# Altium project PiezoControlBoard.PrjPcb (part 2 of 2)

## Sheet Power_Management.SchDoc
size 419 x 297 mm; SheetNumber: 2; SheetTotal: 5
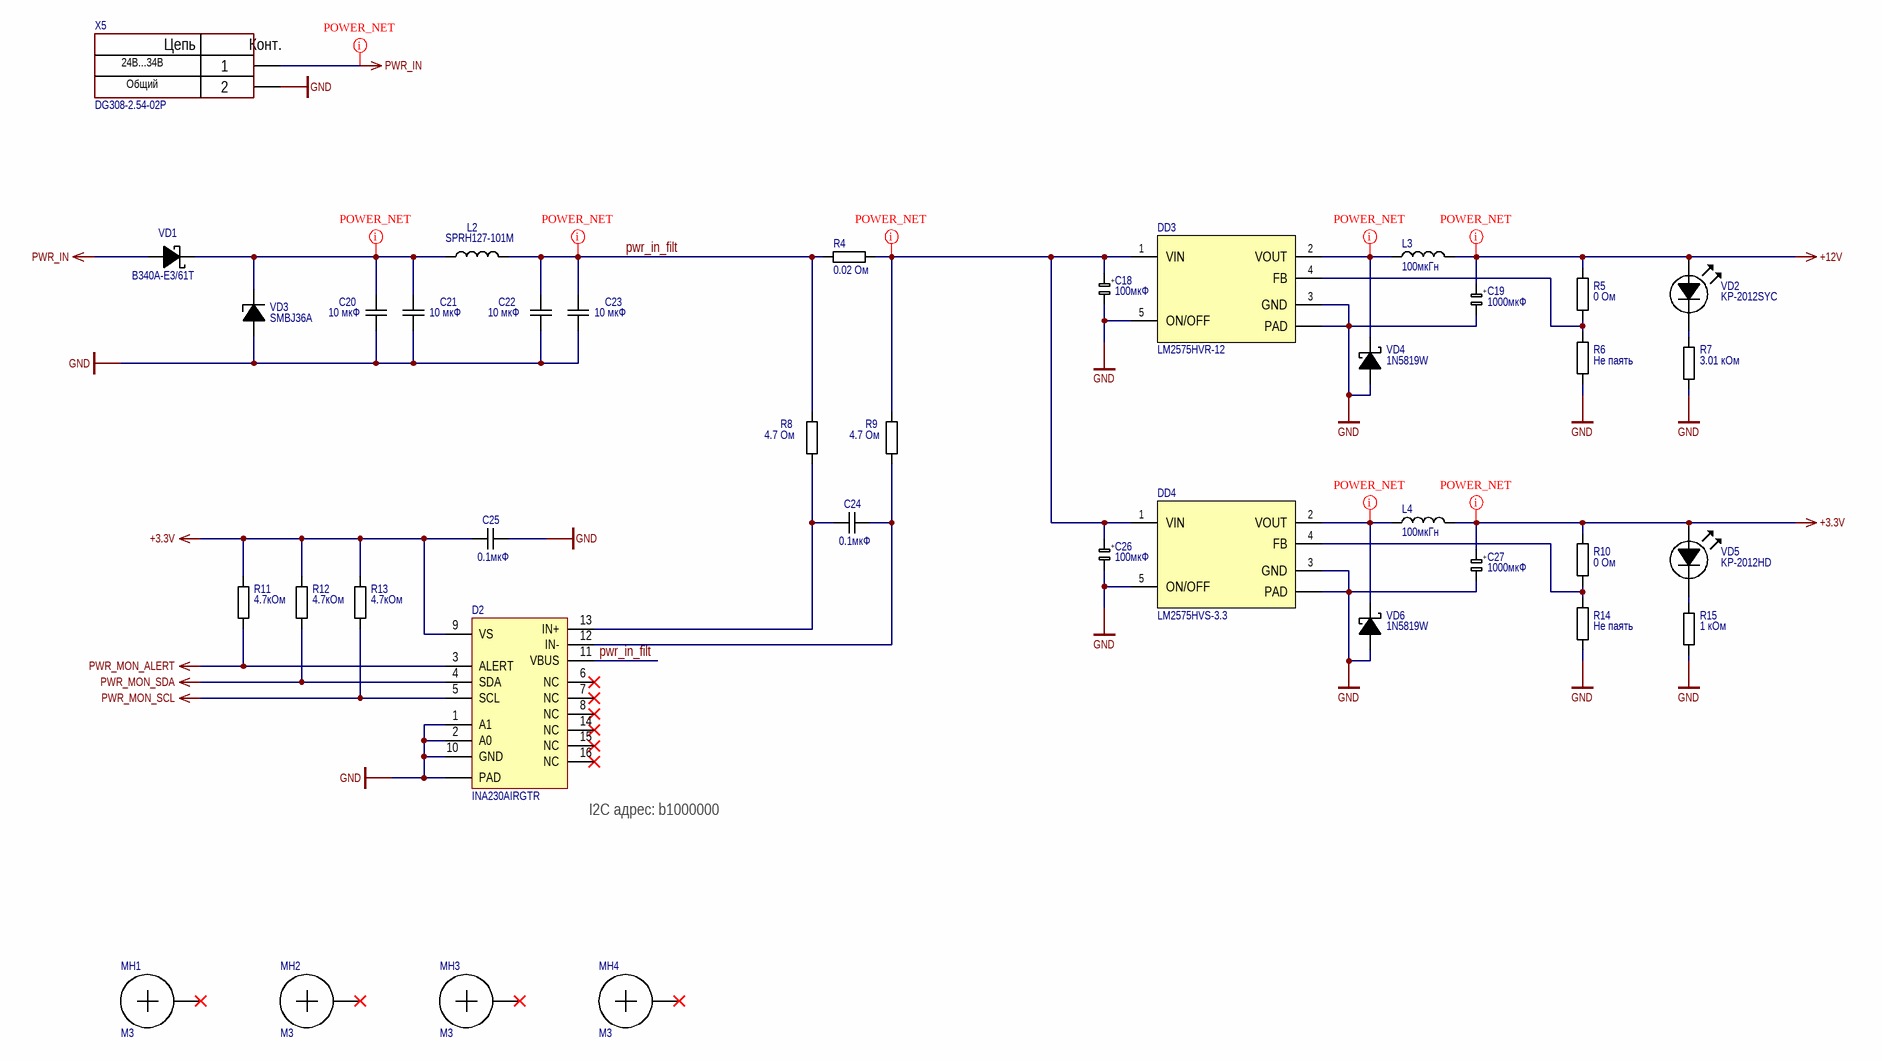
[diagram p1: Power_Management.SchDoc]

### Parts
(Parts that share a designator on the sheet are numbered #1, #2 ... from top to bottom, then left to right.)
C18#2  value 100мкФ  [CAP_RADIAL_10x20_P5]  (hidden comment: CAP-100мкФ-20%-100В-105°C-Radial)
C19#2  value 1000мкФ  [CAP_RADIAL_10x20_P5]  (hidden comment: CAP-1000мкФ-20%-25В-105°C-Radial)
C20  value 10 мкФ  [CAP_1206]  (hidden comment: CAP-10 мкФ-10%-50 В-X5R-1206)
C21  value 10 мкФ  [CAP_1206]  (hidden comment: CAP-10 мкФ-10%-50 В-X5R-1206)
C22  value 10 мкФ  [CAP_1206]  (hidden comment: CAP-10 мкФ-10%-50 В-X5R-1206)
C23  value 10 мкФ  [CAP_1206]  (hidden comment: CAP-10 мкФ-10%-50 В-X5R-1206)
C24  value 0.1мкФ  [CAP-0603]  (hidden comment: CAP-0.1мкФ-10%-50В-X7R-0603)
C25  value 0.1мкФ  [CAP-0603]  (hidden comment: CAP-0.1мкФ-10%-50В-X7R-0603)
C26  value 100мкФ  [CAP_RADIAL_10x20_P5]  (hidden comment: CAP-100мкФ-20%-100В-105°C-Radial)
C27  value 1000мкФ  [CAP_RADIAL_10x20_P5]  (hidden comment: CAP-1000мкФ-20%-25В-105°C-Radial)
D2  INA230AIRGTR  [VQFN-16]
DD3  LM2575HVR-12  [TO-263-5]
DD4  LM2575HVS-3.3  [TO-263-5]
L2  SPRH127-101M  [IND_SPRH127-101M]
L3  100мкГн  [IND_10.4X10.4]
L4  100мкГн  [IND_10.4X10.4]
MH1  M3  [M3]  (no BOM)
MH2  M3  [M3]  (no BOM)
MH3  M3  [M3]  (no BOM)
MH4  M3  [M3]  (no BOM)
R4#2  value 0.02 Ом  [RES-2512]  (hidden comment: RES-0.02 Ом-1%-3 Вт-2512)
R5#2  value 0 Ом  [RES-0402]  (hidden comment: RES-0 Ом-5%-0.062 Вт-0402)
R6#2  value Не паять  [RES-0402]  (hidden comment: RES-Не паять-----0402)
R7#2  value 3.01 кОм  [RES-0805]  (hidden comment: RES-3.01 кОм-1%-0.125Вт-0805)
R8#2  value 4.7 Ом  [RES-0402]  (hidden comment: RES-4.7 Ом-5%-0.062 Вт-0402)
R9#2  value 4.7 Ом  [RES-0402]  (hidden comment: RES-4.7 Ом-5%-0.062 Вт-0402)
R10  value 0 Ом  [RES-0402]  (hidden comment: RES-0 Ом-5%-0.062 Вт-0402)
R11  value 4.7кОм  [RES-0402]  (hidden comment: RES-4.7кОм-5%-0.062Вт-0402)
R12  value 4.7кОм  [RES-0402]  (hidden comment: RES-4.7кОм-5%-0.062Вт-0402)
R13  value 4.7кОм  [RES-0402]  (hidden comment: RES-4.7кОм-5%-0.062Вт-0402)
R14  value Не паять  [RES-0402]  (hidden comment: RES-Не паять-----0402)
R15  value 1 кОм  [RES-0805]  (hidden comment: RES-1 кОм-1%-0.125Вт-0805)
VD1#2  B340A-E3/61T  [DO-214AC]
VD2#2  KP-2012SYC  [LED 0805]
VD3  SMBJ36A  [DO-214AA]
VD4  1N5819W  [SOD-123]
VD5  KP-2012HD  [LED 0805]
VD6  1N5819W  [SOD-123]
X5#2  DG308-2.54-02P  Curciut 2: Общий  Curciut 1: 24В...34В  [DG30825402P1400AH]

### Nets
+3.3V: C25.1 C27.P D2.9(VS) L4.2 R10.2 R11.2 R12.2 R13.2 VD5.1(A)
+12V: C19#2.P L3.2 R5#2.2 VD2#2.1(A)
GND: C18#2.N C19#2.N C20.1 C21.1 C22.1 C23.1 C25.2 C26.N C27.N D2.1(A1) D2.2(A0) D2.10(GND) D2.PAD DD3.3(GND) DD3.5(ON/OFF) DD3.PAD DD4.3(GND) DD4.5(ON/OFF) DD4.PAD R6#2.1 R7#2.1 R14.1 R15.1 VD3.A VD4.1(A) VD6.1(A) X5#2.2
PWR_IN: VD1#2.A X5#2.1
PWR_MON_ALERT: D2.3(ALERT) R11.1
PWR_MON_SCL: D2.5(SCL) R13.1
PWR_MON_SDA: D2.4(SDA) R12.1
pwr_in_filt: C22.2 C23.2 D2.11(VBUS) L2.2 R4#2.1 R8#2.2
NetC18#2_P: C18#2.P C26.P DD3.1(VIN) DD4.1(VIN) R4#2.2 R9#2.2
NetC20_2: C20.2 C21.2 L2.1 VD1#2.C VD3.C
NetC24_1: C24.1 D2.13(IN+) R8#2.1
NetC24_2: C24.2 D2.12(IN-) R9#2.1
NetDD3_2: DD3.2(VOUT) L3.1 VD4.2(K)
NetDD3_4: DD3.4(FB) R5#2.1 R6#2.2
NetDD4_2: DD4.2(VOUT) L4.1 VD6.2(K)
NetDD4_4: DD4.4(FB) R10.1 R14.2
NetR7#2_2: R7#2.2 VD2#2.2(C)
NetR15_2: R15.2 VD5.2(C)

Not connected (* = marked no-connect by the designer): D2 6(NC)* 7(NC)* 8(NC)* 14(NC)* 15(NC)* 16(NC)*; MH1 1*; MH2 1*; MH3 1*; MH4 1*

### Layout directives
net class POWER_NET: +3.3V, +12V, NetC18#2_P, NetC20_2, NetDD3_2, NetDD4_2, PWR_IN, pwr_in_filt

### Notes on the sheet
- (near D2) I2C адрес: b1000000
- Перв. примен.
- Справ. №
- Подп. и дата
- Инв. № дубл.
- Взам. инв. №
- Изм.
- Лист
- № докум.
- Подп.
- Дата
- Инв. № подл.
- Копировал
- Формат А3
- (in symbol DG308-2.54-02P) Цепь; Конт.
- (in symbol JRB1E102M05001000210000B) +
- (in symbol JRB2A101M05001000200000B) +

### Library data of the parts
C18#2 C26 = JRB2A101M05001000200000B: 100мкФ, 100В, 105°C, 20%, 10x20мм P:5мм, JRB2A101M05001000200000B (К50-35 имп.), Конденсатор электролитический алюминиевый; Tolerance: 20%; Voltage: 100В; Manufacturer Part Number: JRB2A101M05001000200000B; Supplier 1: https://www.chipdip.ru/product/100mkf-100v-105-c-20-10x20mm-p-5mm-jb-capacitors-9000565887; Temperature: 105°C
C19#2 C27 = JRB1E102M05001000210000B: 1000мкФ, 25В, 105°C, 20%, 10x21мм P:5мм, JRB1E102M05001000210000B (К50-35 имп.), Конденсатор электролитический алюминиевый; Tolerance: 20%; Voltage: 25В; Manufacturer Part Number: JRB1E102M05001000210000B; Supplier 1: https://www.chipdip.ru/product/1000mkf-25v-105-c-20-10x21mm-p-5mm-jb-capacitors-9000565924; Temperature: 105°C
C20-C23 = Cap_1206: Конденсатор; Manufacturer Part Number: GRM31CR61H106KA12L; Tolerance: 10%; Voltage: 50 В; Temperature: X5R; Supplier 1: https://www.chipdip.ru/product0/9000332404
C24 C25 = Cap_0603: Конденсатор; Manufacturer Part Number: GRM188R71H104K; Tolerance: 10%; Voltage: 50В; Temperature: X7R; Supplier 1: https://www.chipdip.ru/product/grm188r71h104k
D2 = INA230AIRGTR: 36-V, 16-bit, I²C output current, voltage and power monitor with alert 16-VQFN -40 to 125; Manufacturer: Texas Instruments; Supplier: Digikey; Supplier Part Number: 296-36594-1-ND; Manufacturer Part Number: INA230AIRGTR; RoHS: Yes; Category: Amplifiers - Op Amps, Buffer, Instrumentation; Stock: 3132; Pricing: 1=2,83, 10=2,543, 25=2,3988, 100=2,0437, 250=1,919, 500=1,67912, 1000=1,39128 (USD); ComponentLink1URL: https://datasheet.ciiva.com/15132/getdatasheetpartid-614336-15132773.pdf?src-supplier=Verical; ComponentLink1Description: https://datasheet.ciiva.com/15132/getdatasheetpartid-614336-15132773.pdf?src-supplier=Verical; ComponentLink2URL: https://datasheet.ciiva.com/2965/ina230-2965732.pdf?src-supplier=Avnet; ComponentLink2Description: https://datasheet.ciiva.com/2965/ina230-2965732.pdf?src-supplier=Avnet; ComponentLink3URL: https://datasheet.ciiva.com/29609/ina230-29609254.pdf?src-supplier=Digikey; ComponentLink3Description: https://datasheet.ciiva.com/29609/ina230-29609254.pdf?src-supplier=Digikey; ComponentLink4URL: https://datasheet.ciiva.com/29609/ina230-29609255.pdf?src-supplier=Digikey; ComponentLink4Description: https://datasheet.ciiva.com/29609/ina230-29609255.pdf?src-supplier=Digikey; ComponentLink5URL: https://datasheet.ciiva.com/29609/ina230-29609256.pdf?src-supplier=Digikey; ComponentLink5Description: https://datasheet.ciiva.com/29609/ina230-29609256.pdf?src-supplier=Digikey; Supplier 1: https://www.chipdip.ru/product0/8004605923?ysclid=m1f43nxnn781516536
DD3 = LM2575HVR-12: LM2575HVR-12, Понижающий DC-DC преобразователь, Uвх=до 60В, Uвых=+12В, 1А, 52кГц [TO-263-5L] (=LM2575HVS-12); Supplier 1: https://www.chipdip.ru/product/lm2575hvr-12-ponizhayuschiy-dc-dc-preobrazovatel-uvh-do-htc-9001087020
DD4 = LM2575HVS-3.3: LM2575HVS-3.3, Понижающий DC-DC преобразователь, Uвх=до 60В, Uвых=3.3В, 1А, 52кГц [TO-263-5L]; Supplier 1: https://www.chipdip.ru/product/lm2575hvs-3.3-ponizhayuschiy-dc-dc-preobrazovatel-umw-9001231209
L2 = SPRH127-101M: SMD Low Loss Power Inductor; Manufacturer: Codaca; Supplier: Digikey; Supplier Part Number: 4044-SPRH127-101MCT-ND; Manufacturer Part Number: SPRH127-101M; RoHS: No; Stock: 3159; Pricing: 1=1,13, 10=0,93, 100=0,7645 (USD); Supplier 1: https://www.chipdip.ru/product/sprh127-101m-100
L3 L4 = B82464G4104M000: Inductor Power Shielded Wirewound 100uH 20% 100KHz Ferrite 1.05A 0.22Ohm DCR Automotive T/R; Manufacturer: EPCOS; DC Resistance (DCR): 220mΩ; Inductance: 100µH; Number of Circuits: 1; Saturation Current: 1.15A; Self Resonant Frequency: 6.5MHz; Manufacturer Part Number: B82464G4104M000; RoHS: Compliant; Category: Fixed Inductors; Stock 1: 363; Pricing 1: 1=1,09 (GBP); Case/Package: SMD/SMT; China RoHS: Compliant; Contact Plating: Tin; Core Material: Ferrite; Country of Origin: Germany; DC Current: 1.05A; Depth: 10.4mm; Export Control Classification Number (ECCN) Code: EAR99; Height: 4.8mm; Harmonized Tariff Schedule (HTS) Code: 8504.50.80.00; Inductance Tolerance: 20%; Introduction Date: 2002-08-13; Lead Free: Lead Free; Length: 10.4mm; Lifecycle Status: EOL; Max Current Rating: 1.05A; Max DC Current: 1.05A; Max Length: 10.4mm; Max Operating Temperature: 125°C; Max Width: 10.4mm; Military Standard: Not; Min Operating Temperature: -55°C; Mount: Surface Mount; Number of Pins: 2; Number of Terminals: 2; Packaging: Cut Tape; REACH SVHC: Yes; Resistance: 220mΩ; RMS Current (Irms): 1.05A; Schedule B: 8504500000, 8504500000|8504500000|8504500000|8504500000|8504500000; Test Frequency: 100kHz; Tolerance: 20%; Width: 10.4mm; ComponentLink1URL: https://datasheet.octopart.com:443/B82464G4104M000-EPCOS-datasheet-138895962.pdf?src-supplier=IHS; ComponentLink1Description: https://datasheet.octopart.com:443/B82464G4104M000-EPCOS-datasheet-138895962.pdf?src-supplier=IHS; ComponentLink2URL: https://datasheet.octopart.com:443/B82464G4104M000-EPCOS-datasheet-12510517.pdf?src-supplier=Newark; ComponentLink2Description: https://datasheet.octopart.com:443/B82464G4104M000-EPCOS-datasheet-12510517.pdf?src-supplier=Newark; ComponentLink3URL: https://datasheet.octopart.com:443/B82464G4104M000-EPCOS-datasheet-10671.pdf?src-supplier=Newark; ComponentLink3Description: https://datasheet.octopart.com:443/B82464G4104M000-EPCOS-datasheet-10671.pdf?src-supplier=Newark; ComponentLink4URL: https://datasheet.octopart.com:443/B82464G4104M000-EPCOS-datasheet-8324944.pdf?src-supplier=Future+Electronics; ComponentLink4Description: https://datasheet.octopart.com:443/B82464G4104M000-EPCOS-datasheet-8324944.pdf?src-supplier=Future+Electronics; ComponentLink5URL: https://datasheet.octopart.com:443/B82464G4104M000-EPCOS-datasheet-47871567.pdf?src-supplier=Future+Electronics; ComponentLink5Description: https://datasheet.octopart.com:443/B82464G4104M000-EPCOS-datasheet-47871567.pdf?src-supplier=Future+Electronics; ComponentLink6URL: https://datasheet.octopart.com:443/B82464G4104M000-EPCOS-datasheet-38579530.pdf?src-supplier=element14+APAC; ComponentLink6Description: https://datasheet.octopart.com:443/B82464G4104M000-EPCOS-datasheet-38579530.pdf?src-supplier=element14+APAC; ComponentLink7URL: https://datasheet.octopart.com:443/B82464G4104M-EPCOS-datasheet-714.pdf?src-supplier=TME; ComponentLink7Description: https://datasheet.octopart.com:443/B82464G4104M-EPCOS-datasheet-714.pdf?src-supplier=TME; ComponentLink8URL: https://datasheet.octopart.com:443/B82464G4104M-EPCOS-datasheet-519163.pdf?src-supplier=Farnell; ComponentLink8Description: https://datasheet.octopart.com:443/B82464G4104M-EPCOS-datasheet-519163.pdf?src-supplier=Farnell; ComponentLink9URL: https://datasheet.octopart.com:443/B82464G4104M-EPCOS-datasheet-499776.pdf?src-supplier=Farnell; ComponentLink9Description: https://datasheet.octopart.com:443/B82464G4104M-EPCOS-datasheet-499776.pdf?src-supplier=Farnell; ComponentLink10URL: https://datasheet.octopart.com:443/B82464-G4104-M-EPCOS-datasheet-550296.pdf?src-supplier=Verical; ComponentLink10Description: https://datasheet.octopart.com:443/B82464-G4104-M-EPCOS-datasheet-550296.pdf?src-supplier=Verical; Supplier Part Number 1: 4960669; Supplier 1: https://www.chipdip.ru/product/b82464g4104m-100mkgn-1.05a-10x10-katushka-epcos-759264303?from=visited_product; Supplier: RS
MH1-MH4 = M3: отверстие М3
R4#2 = Res_2512: Резистор; Manufacturer Part Number: CRA2512-FZ-R020ELF; Power: 3 Вт; Tolerance: 1%; Supplier 1: https://www.chipdip.ru/product0/8002006585
R5#2 R10 = Res_0402: Резистор; Manufacturer Part Number: RC0402JR-070RL; Tolerance: 5%; Power: 0.062 Вт; Supplier 1: https://www.chipdip.ru/product/0.062w-0402-0-om-5
R6#2 R14 = Res_0402: Резистор; Tolerance: -; Power: -; Manufacturer Part Number: -; Supplier 1: -
R7#2 = Res_0805: Резистор; Manufacturer Part Number: RC0805FR-073K01L; Tolerance: 1%; Power: 0.125Вт; Supplier 1: https://www.chipdip.ru/product0/8013608452
R8#2 R9#2 = Res_0402: Резистор; Manufacturer Part Number: RC0402JR-074R7L; Tolerance: 5%; Power: 0.062 Вт; Supplier 1: https://www.chipdip.ru/product/0.062w-0402-4.7-om-5
R11-R13 = Res_0402: Резистор; Manufacturer Part Number: RC0402JR-074K7L; Tolerance: 5%; Power: 0.062Вт; Supplier 1: https://www.chipdip.ru/product/0.062w-0402-4.7-kom-5
R15 = Res_0805: Резистор; Manufacturer Part Number: CR0805-FX-1001ELF; Tolerance: 1%; Power: 0.125Вт; Supplier 1: https://www.chipdip.ru/product0/8003688062
VD1#2 = B340A-E3/61T: Rectifier Diode, Schottky, 1 Phase, 1 Element, 3A, 40V V(RRM), Silicon, DO-214AC; Manufacturer: Vishay Semiconductors; Supplier: Avnet; Supplier Part Number: B340A-E3/61T; Manufacturer Part Number: B340A-E3/61T; RoHS: Yes; Category: Rectifier Diodes; Stock: 19800; Pricing: 3600=0,11, 7200=0,10732, 10800=0,10602, 18000=0,10476, 36000=0,10353 (USD); ComponentLink1URL: https://datasheet.ciiva.com/22685/1719678-22685665.pdf?src-supplier=Element14; ComponentLink1Description: https://datasheet.ciiva.com/22685/1719678-22685665.pdf?src-supplier=Element14; ComponentLink2URL: https://datasheet.ciiva.com/4245/b330la-4245394.pdf?src-supplier=Arrow+Electronics; ComponentLink2Description: https://datasheet.ciiva.com/4245/b330la-4245394.pdf?src-supplier=Arrow+Electronics; ComponentLink3URL: https://datasheet.ciiva.com/911/b330la-911044.pdf?src-supplier=Digikey; ComponentLink3Description: https://datasheet.ciiva.com/911/b330la-911044.pdf?src-supplier=Digikey; ComponentLink4URL: https://datasheet.ciiva.com/911/b330la-911045.pdf?src-supplier=Digikey; ComponentLink4Description: https://datasheet.ciiva.com/911/b330la-911045.pdf?src-supplier=Digikey; ComponentLink5URL: https://datasheet.ciiva.com/911/b330la-911046.pdf?src-supplier=Digikey; ComponentLink5Description: https://datasheet.ciiva.com/911/b330la-911046.pdf?src-supplier=Digikey; Supplier 1: https://www.chipdip.ru/product/b340a-e3-61t-2?from=suggest_product
VD2#2 VD5 = LED 0805: LED SMD 0805
  VD2#2: Part Number: KP-2012SYC; Supplier 1: https://www.chipdip.ru/product0/8001782012
  VD5: Part Number: KP-2012HD; Supplier 1: https://www.chipdip.ru/product0/8001788575
VD3 = SMBJ36A: SMBJ36A, Защитный диод 600Вт 36В [SMB / DO-214AA]; Supplier 1: https://www.chipdip.ru/product/smbj36a-zaschitnyy-diod-600vt-36v-smb-do-214aa-umw-9001169227
VD4 VD6 = 1N5819W: Диод Шоттки 40В 1А; Supplier 1: https://www.chipdip.ru/product/1n5819w
X5#2 = DG308-2.54-02P: Клеммник 2 конт. шаг 2.54 мм, вертик. на плату, H = 8.5 мм, провод под винт/микролифт (пров. 26-18AWG/ до 1.0 кв.мм), до 150В/6А, зеленый изол.; Supplier 1: https://www.chipdip.ru/product/dg308-2.54-02p-14-00ah-308-021-14-klemmnik-vintovoy-degson-63066?from=visited_product

## Sheet HV_Piezo_Driver.SchDoc
size 419 x 297 mm; SheetNumber: 3; SheetTotal: 4
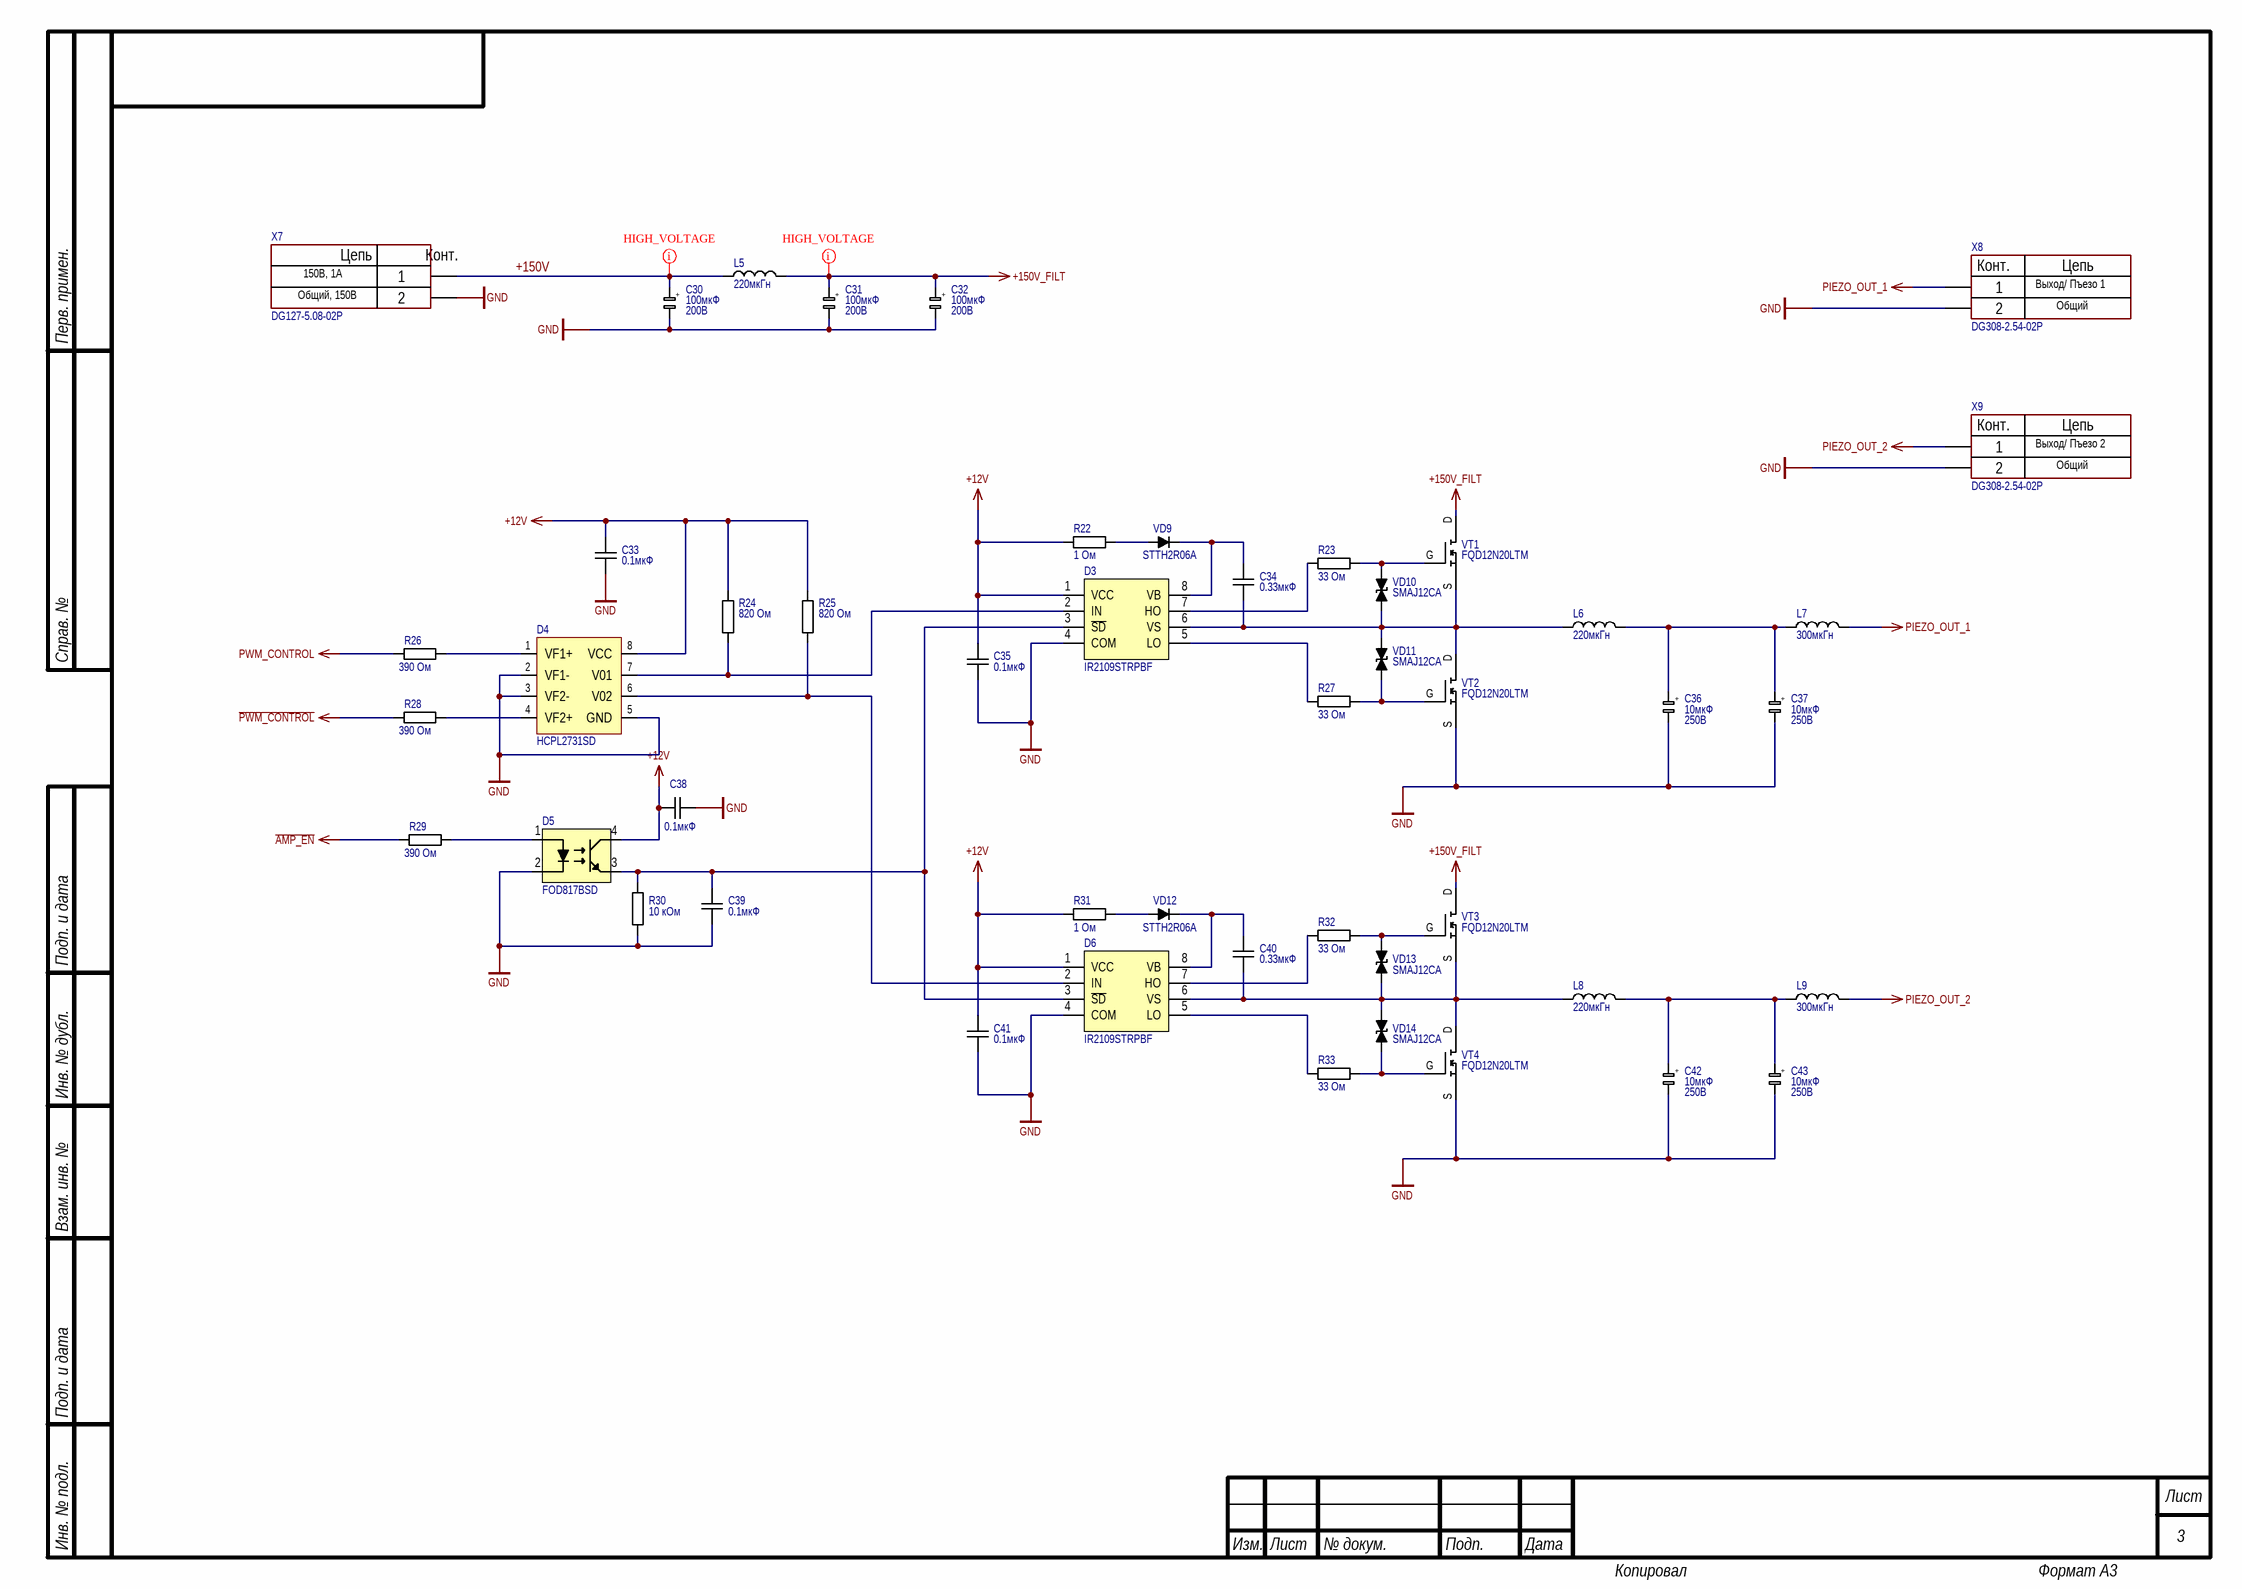
[diagram p2: HV_Piezo_Driver.SchDoc]

### Parts
C30  value 100мкФ  Voltage: 200В  [CAP_RADIAL_13x17_P5]  (hidden comment: CAP-100мкФ-20%-200В-105°C-Radial)
C31  value 100мкФ  Voltage: 200В  [CAP_RADIAL_13x17_P5]  (hidden comment: CAP-100мкФ-20%-200В-105°C-Radial)
C32  value 100мкФ  Voltage: 200В  [CAP_RADIAL_13x17_P5]  (hidden comment: CAP-100мкФ-20%-200В-105°C-Radial)
C33  value 0.1мкФ  [CAP-0603]  (hidden comment: CAP-0.1мкФ-10%-50В-X7R-0603)
C34  value 0.33мкФ  [CAP-0805]  (hidden comment: CAP-0.33мкФ-10%-25В-X7R-0805)
C35  value 0.1мкФ  [CAP-0603]  (hidden comment: CAP-0.1мкФ-10%-50В-X7R-0603)
C36  value 10мкФ  Voltage: 250В  [CAP_RADIAL_10x20_P5]  (hidden comment: CAP-10мкФ-20%-250В-105°C-Radial)
C37  value 10мкФ  Voltage: 250В  [CAP_RADIAL_10x20_P5]  (hidden comment: CAP-10мкФ-20%-250В-105°C-Radial)
C38  value 0.1мкФ  [CAP-0603]  (hidden comment: CAP-0.1мкФ-10%-50В-X7R-0603)
C39  value 0.1мкФ  [CAP-0603]  (hidden comment: CAP-0.1мкФ-10%-50В-X7R-0603)
C40  value 0.33мкФ  [CAP-0805]  (hidden comment: CAP-0.33мкФ-10%-25В-X7R-0805)
C41  value 0.1мкФ  [CAP-0603]  (hidden comment: CAP-0.1мкФ-10%-50В-X7R-0603)
C42  value 10мкФ  Voltage: 250В  [CAP_RADIAL_10x20_P5]  (hidden comment: CAP-10мкФ-20%-250В-105°C-Radial)
C43  value 10мкФ  Voltage: 250В  [CAP_RADIAL_10x20_P5]  (hidden comment: CAP-10мкФ-20%-250В-105°C-Radial)
D3  IR2109STRPBF  [SOIC-8]
D4  HCPL2731SD  [SMD-8]
D5  FOD817BSD  [SMD-4]
D6  IR2109STRPBF  [SOIC-8]
L5  Inductance: 220мкГн  [IND_12.3X12.3]  (hidden comment: SPRH127-221M)
L6  Inductance: 220мкГн  [IND_12.3X12.3]  (hidden comment: SPRH127-221M)
L7  Inductance: 300мкГн  [IND_7.8X7.8]  (hidden comment: SDR0805-331KL)
L8  Inductance: 220мкГн  [IND_12.3X12.3]  (hidden comment: SPRH127-221M)
L9  Inductance: 300мкГн  [IND_7.8X7.8]  (hidden comment: SDR0805-331KL)
R22  value 1 Ом  [RES-1206]  (hidden comment: RES-1 Ом-5%-0.25Вт-1206)
R23  value 33 Ом  [RES-1206]  (hidden comment: RES-33 Ом-5%-0,25Вт-1206)
R24  value 820 Ом  [RES-1206]  (hidden comment: RES-820 Ом-5%-0.25Вт-1206)
R25  value 820 Ом  [RES-1206]  (hidden comment: RES-820 Ом-5%-0.25Вт-1206)
R26  value 390 Ом  [RES-0603]  (hidden comment: RES-390 Ом-5%-250мВт-0603)
R27  value 33 Ом  [RES-1206]  (hidden comment: RES-33 Ом-5%-0,25Вт-1206)
R28  value 390 Ом  [RES-0603]  (hidden comment: RES-390 Ом-5%-250мВт-0603)
R29  value 390 Ом  [RES-0603]  (hidden comment: RES-390 Ом-5%-250мВт-0603)
R30  value 10 кОм  [RES-0603]  (hidden comment: RES-10 кОм-5%-0.1Вт-0603)
R31  value 1 Ом  [RES-1206]  (hidden comment: RES-1 Ом-5%-0.25Вт-1206)
R32  value 33 Ом  [RES-1206]  (hidden comment: RES-33 Ом-5%-0,25Вт-1206)
R33  value 33 Ом  [RES-1206]  (hidden comment: RES-33 Ом-5%-0,25Вт-1206)
VD9  STTH2R06A  [SMA]
VD10  SMAJ12CA  [DO-214AC]
VD11  SMAJ12CA  [DO-214AC]
VD12  STTH2R06A  [SMA]
VD13  SMAJ12CA  [DO-214AC]
VD14  SMAJ12CA  [DO-214AC]
VT1  FQD12N20LTM  [DPAK3]
VT2  FQD12N20LTM  [DPAK3]
VT3  FQD12N20LTM  [DPAK3]
VT4  FQD12N20LTM  [DPAK3]
X7  DG127-5.08-02P  Curciut 2: Общий, 150В  Curciut 1: 150В, 1А  [DG12750802P141000AH]
X8  DG308-2.54-02P  Curciut 2: Общий  Curciut 1: Выход/ Пъезо 1  [DG30825402P1400AH]
X9  DG308-2.54-02P  Curciut 2: Общий  Curciut 1: Выход/ Пъезо 2  [DG30825402P1400AH]

### Nets
+12V: C33.2 C35.2 C38.2 C41.2 D3.1(VCC) D4.8(VCC) D5.4(COLLECTOR) D6.1(VCC) R22.1 R24.2 R25.2 R31.1
+150V_FILT: C31.P C32.P L5.2 VT1.D VT3.D
~{AMP_EN}: R29.1
GND: C30.N C31.N C32.N C33.1 C35.1 C36.N C37.N C38.1 C39.1 C41.1 C42.N C43.N D3.4(COM) D4.2(VF1-) D4.3(VF2-) D4.5(GND) D5.2(CATHODE) D6.4(COM) R30.1 VT2.S VT4.S X7.2 X8.2 X9.2
~{PWM_CONTROL}: R28.1
PIEZO_OUT_1: L7.2 X8.1
PIEZO_OUT_2: L9.2 X9.1
PWM_CONTROL: R26.1
+150V: C30.P L5.1 X7.1
NetC34_1: C34.1 D3.6(VS) L6.1 VD10.C VD11.A VT1.S VT2.D
NetC34_2: C34.2 D3.8(VB) VD9.2(A)
NetC36_P: C36.P C37.P L6.2 L7.1
NetC39_2: C39.2 D3.3(~{SD}) D5.3(EMITTER) D6.3(~{SD}) R30.2
NetC40_1: C40.1 D6.6(VS) L8.1 VD13.C VD14.A VT3.S VT4.D
NetC40_2: C40.2 D6.8(VB) VD12.2(A)
NetC42_P: C42.P C43.P L8.2 L9.1
NetD3_2: D3.2(IN) D4.7(V01) R24.1
NetD3_5: D3.5(LO) R27.1
NetD3_7: D3.7(HO) R23.1
NetD4_1: D4.1(VF1+) R26.2
NetD4_4: D4.4(VF2+) R28.2
NetD4_6: D4.6(V02) D6.2(IN) R25.1
NetD5_1: D5.1(ANODE) R29.2
NetD6_5: D6.5(LO) R33.1
NetD6_7: D6.7(HO) R32.1
NetR22_2: R22.2 VD9.1(K)
NetR23_2: R23.2 VD10.A VT1.G
NetR27_2: R27.2 VD11.C VT2.G
NetR31_2: R31.2 VD12.1(K)
NetR32_2: R32.2 VD13.A VT3.G
NetR33_2: R33.2 VD14.C VT4.G

### Layout directives
net class HIGH_VOLTAGE: +150V, +150V_FILT

### Notes on the sheet
- Перв. примен.
- Справ. №
- Подп. и дата
- Инв. № дубл.
- Взам. инв. №
- Изм.
- Лист
- № докум.
- Подп.
- Дата
- Инв. № подл.
- Копировал
- Формат А3
- (in symbol DG127-5.08-02P) Цепь; Конт.
- (in symbol DG308-2.54-02P) Конт.; Цепь
- (in symbol JRB2D101M05001300250000B) +
- (in symbol JRB2E100M05001000170000B) +

### Library data of the parts
C30-C32 = JRB2D101M05001300250000B: 100мкФ, 200В, 105°C, 20%, 13x25мм P:5мм, JRB2D101M05001300250000B (К50-35 имп.), Конденсатор электролитический алюминиевый; Supplier 1: https://www.chipdip.ru/product/100mkf-200v-105-c-20-13x25mm-p-5mm-jb-capacitors-9000565896; Tolerance: 20%; Manufacturer Part Number: JRB2D101M05001300250000B; Temperature: 105°C
C33 C35 C38 C39 C41 = Cap_0603: as C24 on sheet Power_Management; Temperature: X7R; Supplier 1: https://www.chipdip.ru/product/0.1mkf-x7r-50v-10-0603-grm188r71h104k-kondensator-murata-32715842
C34 C40 = Cap_0805: Конденсатор; Manufacturer Part Number: GRM21BR71E334K; Tolerance: 10%; Voltage: 25В; Temperature: X7R; Supplier 1: https://www.chipdip.ru/product/0.33mkf-x7r-25v-10-0805-grm21br71e334k-kondensator-murata-263924069
C36 C37 C42 C43 = JRB2E100M05001000170000B: 10мкФ, 250В, 105°C, 20%, 10x17мм P:5мм, JRB2E100M05001000170000B (К50-35 имп.), Конденсатор электролитический алюминиевый; Supplier 1: https://www.chipdip.ru/product/10mkf-250v-105-c-20-10x17mm-p-5mm-jb-capacitors-9000565843; Tolerance: 20%; Manufacturer Part Number: JRB2E100M05001000170000B; Temperature: 105°C
D3 D6 = IR2109STRPBF: Драйвер полумостовой; Operating Supply Current: 1.6 mA; Output Current: 120 mA; Output Voltage -Min: 10 V; Output Voltage - Max: 20 V; Power: 625mW; Supplier 1: https://www.chipdip.ru/product/ir2109strpbf-infineon-8012901923; Supply Voltage -Min: 10 V; Supply Voltage -Max: 20 V; Operating temperature: -40…125°C
D4 = HCPL2731SD: Оптоизолятор 2.5кВ двухканальный с транзистором Дарлингтона 8SMD; Output Current: 60 mA; Vf - Forward Voltage: 1.3 V; Vr - Reverse Voltage: 5 V; If - Forward Current: 1.6 mA; Supplier 1: https://www.chipdip.ru/product/hcpl2731sd-on-semiconductor-8031911084; Maximum Operating Temperature: 100 C; Minimum Operating Temperature: -40 C
D5 = FOD817BSD: Optocoupler, Transistor Output, 1 Channel, Surface Mount DIP, 4 Pins, 50 mA, 5 kV, 130 %; Manufacturer: onsemi; Manufacturer Lifecycle Status: ACTIVE; Collector Emitter Breakdown Voltage: 70V; Collector Emitter Saturation Voltage: 200mV; Current Transfer Ratio: 130%; Dark Current: 100nA; Fall Time: 18µs; Forward Current: 50mA; Forward Voltage: 1.4V; Isolation Voltage: 5kV; Max Junction Temperature (Tj): 125°C; Max Power Dissipation: 150mW; Number of Channels: 1; Power Dissipation: 200mW; Reverse Breakdown Voltage: 6V; Supplier: Future Electronics; Supplier Part Number: 1190577; Manufacturer Part Number: FOD817BSD; RoHS: Compliant; Category: Optocouplers; Stock: 578000; Pricing: 1000=0,0878, 3000=0,0853, 4000=0,0847, 10000=0,0827, 15000=0,0807 (USD); Case/Package: SMD/SMT; China RoHS: Compliant; Collector Emitter Voltage (VCEO): 70V; Contact Plating: Tin; Country of Origin: Thailand; Export Control Classification Number (ECCN) Code: EAR99; Height: 4.35mm; Harmonized Tariff Schedule (HTS) Code: 8541.40.80.00; Input Current: 50mA; Introduction Date: 2004-04-28; Lead Free: Lead Free; Length: 5.1mm; Lifecycle Status: Production; Max Collector Current: 50mA; Max Input Current: 50mA; Max Operating Temperature: 110°C; Max Output Voltage: 70V; Min Operating Temperature: -55°C; Mounting Technology: Surface Mount; Number of Circuits: 1; Number of Elements: 1; Pins: 4; Output Current per Channel: 50mA; Output Voltage: 70V; Radiation Hardening: No; REACH SVHC: Yes; Reverse Voltage: 6V; Reverse Voltage (DC): 6V; Rise Time: 18µs; Schedule B: 8541408000, 8541408000|8541408000, 8541408000|8541408000|8541408000, 8541408000|8541408000|8541408000|8541408000; Weight: 0g; Width: 7mm; ComponentLink1URL: https://datasheet.octopart.com:443/FOD817BSD-onsemi-datasheet-180960478.pdf?src-supplier=IHS; ComponentLink1Description: https://datasheet.octopart.com:443/FOD817BSD-onsemi-datasheet-180960478.pdf?src-supplier=IHS; ComponentLink2URL: https://datasheet.octopart.com:443/FOD817BSD-Fairchild-Semiconductor-datasheet-67010145.pdf?src-supplier=IHS; ComponentLink2Description: https://datasheet.octopart.com:443/FOD817BSD-Fairchild-Semiconductor-datasheet-67010145.pdf?src-supplier=IHS; ComponentLink3URL: https://datasheet.octopart.com:443/FOD817BSD-ON-Semiconductor-datasheet-113093828.pdf?src-supplier=JRH+Electronics; ComponentLink3Description: https://datasheet.octopart.com:443/FOD817BSD-ON-Semiconductor-datasheet-113093828.pdf?src-supplier=JRH+Electronics; ComponentLink4URL: https://sigma.octopart.com:443/138799925/technical_drawing/ON-Semiconductor-FOD817BSD.pdf?src-supplier=Upverter; ComponentLink4Description: https://sigma.octopart.com:443/138799925/technical_drawing/ON-Semiconductor-FOD817BSD.pdf?src-supplier=Upverter; ComponentLink5URL: https://datasheet.octopart.com:443/FOD817BSD-ON-Semiconductor-datasheet-11629806.pdf?src-supplier=TME; ComponentLink5Description: https://datasheet.octopart.com:443/FOD817BSD-ON-Semiconductor-datasheet-11629806.pdf?src-supplier=TME; ComponentLink6URL: https://datasheet.octopart.com:443/FOD817BSD-onsemi-datasheet-188912653.pdf?src-supplier=TME; ComponentLink6Description: https://datasheet.octopart.com:443/FOD817BSD-onsemi-datasheet-188912653.pdf?src-supplier=TME; ComponentLink7URL: https://datasheet.octopart.com:443/FOD817BSD-ON-Semiconductor-datasheet-99207756.pdf?src-supplier=Future+Electronics; ComponentLink7Description: https://datasheet.octopart.com:443/FOD817BSD-ON-Semiconductor-datasheet-99207756.pdf?src-supplier=Future+Electronics; ComponentLink8URL: https://datasheet.octopart.com:443/FOD817BSD-Fairchild-Semiconductor-datasheet-8324556.pdf?src-supplier=Future+Electronics; ComponentLink8Description: https://datasheet.octopart.com:443/FOD817BSD-Fairchild-Semiconductor-datasheet-8324556.pdf?src-supplier=Future+Electronics; ComponentLink9URL: https://datasheet.octopart.com:443/FOD817BSD-ON-Semiconductor-datasheet-98551328.pdf?src-supplier=onsemi; ComponentLink9Description: https://datasheet.octopart.com:443/FOD817BSD-ON-Semiconductor-datasheet-98551328.pdf?src-supplier=onsemi; ComponentLink10URL: https://datasheet.octopart.com:443/FOD817BSD-ON-Semiconductor-datasheet-85522120.pdf?src-supplier=onsemi; ComponentLink10Description: https://datasheet.octopart.com:443/FOD817BSD-ON-Semiconductor-datasheet-85522120.pdf?src-supplier=onsemi; ComponentLink11URL: https://datasheet.octopart.com:443/FOD817BSD-ON-Semiconductor-datasheet-86695365.pdf?src-supplier=onsemi; ComponentLink11Description: https://datasheet.octopart.com:443/FOD817BSD-ON-Semiconductor-datasheet-86695365.pdf?src-supplier=onsemi; ComponentLink12URL: https://datasheet.octopart.com:443/FOD817BSD-ON-Semiconductor-datasheet-86689748.pdf?src-supplier=element14+APAC; ComponentLink12Description: https://datasheet.octopart.com:443/FOD817BSD-ON-Semiconductor-datasheet-86689748.pdf?src-supplier=element14+APAC; ComponentLink13URL: https://datasheet.octopart.com:443/FOD817BSD-Fairchild-datasheet-2482.pdf?src-supplier=Mouser; ComponentLink13Description: https://datasheet.octopart.com:443/FOD817BSD-Fairchild-datasheet-2482.pdf?src-supplier=Mouser; ComponentLink14URL: https://datasheet.octopart.com:443/FOD817BSD-Fairchild-Semiconductor-datasheet-49579151.pdf?src-supplier=Newark; ComponentLink14Description: https://datasheet.octopart.com:443/FOD817BSD-Fairchild-Semiconductor-datasheet-49579151.pdf?src-supplier=Newark; ComponentLink15URL: https://datasheet.octopart.com:443/FOD817BSD-ON-Semiconductor-datasheet-91365929.pdf?src-supplier=Newark; ComponentLink15Description: https://datasheet.octopart.com:443/FOD817BSD-ON-Semiconductor-datasheet-91365929.pdf?src-supplier=Newark; ComponentLink16URL: https://datasheet.octopart.com:443/FOD817BSD-onsemi-datasheet-189128609.pdf?src-supplier=Master+Electronics; ComponentLink16Description: https://datasheet.octopart.com:443/FOD817BSD-onsemi-datasheet-189128609.pdf?src-supplier=Master+Electronics; ComponentLink17URL: https://sigma.octopart.com:443/33167772/technical_drawing/Fairchild-Semiconductor-FOD817BSD.pdf?src-supplier=Fairchild+Semiconductor; ComponentLink17Description: https://sigma.octopart.com:443/33167772/technical_drawing/Fairchild-Semiconductor-FOD817BSD.pdf?src-supplier=Fairchild+Semiconductor; ComponentLink18URL: https://sigma.octopart.com:443/17350082/technical_drawing/Fairchild-Semiconductor-FOD817BSD.pdf?src-supplier=Fairchild+Semiconductor; ComponentLink18Description: https://sigma.octopart.com:443/17350082/technical_drawing/Fairchild-Semiconductor-FOD817BSD.pdf?src-supplier=Fairchild+Semiconductor; ComponentLink19URL: https://datasheet.octopart.com:443/FOD817BSD-Fairchild-datasheet-8637997.pdf?src-supplier=Jameco; ComponentLink19Description: https://datasheet.octopart.com:443/FOD817BSD-Fairchild-datasheet-8637997.pdf?src-supplier=Jameco; ComponentLink20URL: https://datasheet.octopart.com:443/FOD817BSD-Fairchild-Semiconductor-datasheet-61452342.pdf?src-supplier=Farnell; ComponentLink20Description: https://datasheet.octopart.com:443/FOD817BSD-Fairchild-Semiconductor-datasheet-61452342.pdf?src-supplier=Farnell; ComponentLink21URL: https://datasheet.octopart.com:443/FOD817BSD-Fairchild-Semiconductor-datasheet-62114928.pdf?src-supplier=Farnell; ComponentLink21Description: https://datasheet.octopart.com:443/FOD817BSD-Fairchild-Semiconductor-datasheet-62114928.pdf?src-supplier=Farnell; ComponentLink22URL: http://sigma.octopart.com:80/150610482/rohs_statement/ON-Semiconductor-FOD817BSD.pdf?src-supplier=Compliance+Statements; ComponentLink22Description: http://sigma.octopart.com:80/150610482/rohs_statement/ON-Semiconductor-FOD817BSD.pdf?src-supplier=Compliance+Statements; ComponentLink23URL: http://sigma.octopart.com:80/17350094/reach_statement/Fairchild-Semiconductor-FOD817BSD.pdf?src-supplier=Compliance+Statements; ComponentLink23Description: http://sigma.octopart.com:80/17350094/reach_statement/Fairchild-Semiconductor-FOD817BSD.pdf?src-supplier=Compliance+Statements; ComponentLink24URL: http://sigma.octopart.com:80/17350098/materials_sheet/Fairchild-Semiconductor-FOD817BSD.pdf?src-supplier=Compliance+Statements; ComponentLink24Description: http://sigma.octopart.com:80/17350098/materials_sheet/Fairchild-Semiconductor-FOD817BSD.pdf?src-supplier=Compliance+Statements; ComponentLink25URL: http://sigma.octopart.com:80/33167956/reach_statement/Fairchild-Semiconductor-FOD817BSD.pdf?src-supplier=Compliance+Statements; ComponentLink25Description: http://sigma.octopart.com:80/33167956/reach_statement/Fairchild-Semiconductor-FOD817BSD.pdf?src-supplier=Compliance+Statements; ComponentLink26URL: http://sigma.octopart.com:80/33167957/materials_sheet/Fairchild-Semiconductor-FOD817BSD.pdf?src-supplier=Compliance+Statements; ComponentLink26Description: http://sigma.octopart.com:80/33167957/materials_sheet/Fairchild-Semiconductor-FOD817BSD.pdf?src-supplier=Compliance+Statements; ComponentLink27URL: http://sigma.octopart.com:80/reach_statement/ON-Semiconductor-company-79.pdf?src-supplier=Compliance+Statements; ComponentLink27Description: http://sigma.octopart.com:80/reach_statement/ON-Semiconductor-company-79.pdf?src-supplier=Compliance+Statements; ComponentLink28URL: http://sigma.octopart.com:80/rohs_statement/Fairchild-Semiconductor-company-11.pdf?src-supplier=Compliance+Statements; ComponentLink28Description: http://sigma.octopart.com:80/rohs_statement/Fairchild-Semiconductor-company-11.pdf?src-supplier=Compliance+Statements; ComponentLink29URL: http://sigma.octopart.com:80/rohs_statement/Fairchild-Semiconductor-company-10.pdf?src-supplier=Compliance+Statements; ComponentLink29Description: http://sigma.octopart.com:80/rohs_statement/Fairchild-Semiconductor-company-10.pdf?src-supplier=Compliance+Statements; ComponentLink30URL: http://sigma.octopart.com:80/reach_statement/Fairchild-Semiconductor-company-9.pdf?src-supplier=Compliance+Statements; ComponentLink30Description: http://sigma.octopart.com:80/reach_statement/Fairchild-Semiconductor-company-9.pdf?src-supplier=Compliance+Statements; ComponentLink31URL: https://octopart.com:443/opatz8j6/c1?t=2OuS15dud8hiB_awp-DQ-07s1LQDF22Cr1fwQKtyVtUYb04vdBjUyNDKKuvr4wkdRxLtERHgqViJqWkTeNBKTdnTkVY2D1nDxfbO5h2fF1LfkcGDWl4D222U1D-tBlXhHTxouI2AVsrzVRemG0SS3H6sW1MSOkrKkFJ4G0RoiKxMnzMg8mILW7BVIW19nuoux7fwrO0RunnQ-qEWRZB9nm4RjI5EnRBraXhhg_8Jbf0Z5zDmWE4pmUtAopGBxl1lqpyawLRVoWByB2PNMH9fKF0UjTc-KtwwjIOepqcHmBTwo6_YdKVeaWahmHfZtg9hUP14M4pE3RtfggEzRX9LWEFlvFULr5TZ0fLS&src-supplier=Compliance+Statements; ComponentLink31Description: https://octopart.com:443/opatz8j6/c1?t=2OuS15dud8hiB_awp-DQ-07s1LQDF22Cr1fwQKtyVtUYb04vdBjUyNDKKuvr4wkdRxLtERHgqViJqWkTeNBKTdnTkVY2D1nDxfbO5h2fF1LfkcGDWl4D222U1D-tBlXhHTxouI2AVsrzVRemG0SS3H6sW1MSOkrKkFJ4G0RoiKxMnzMg8mILW7BVIW19nuoux7fwrO0RunnQ-qEWRZB9nm4RjI5EnRBraXhhg_8Jbf0Z5zDmWE4pmUtAopGBxl1lqpyawLRVoWByB2PNMH9fKF0UjTc-KtwwjIOepqcHmBTwo6_YdKVeaWahmHfZtg9hUP14M4pE3RtfggEzRX9LWEFlvFULr5TZ0fLS&src-supplier=Compliance+Statements; ComponentLink32URL: https://octopart.com:443/opatz8j6/c1?t=FFG_DC80JtruglX_HDP91gzsMwR13fxxkH_F3qcsgv835Sckaqh0XoMMkjr9Xm6n53vUMcFhZdRxZUaOiXKEpziVr_MHF241f_irKM6sV7CDFCSg9OIr6yiMkTD2zr6wiIa6WV_NkigJy29Fhwmg1m-UuSG1FnEbeldEUFG0L2j6ZHDzDhgkJHKMYl647Yu2VnJhiyvnXuXJW9BQy0wQcz7wOqUYovLIYLqOxKZMCY31ibnz1zvaL2IfdgsKEKbqjrdm2M9R683KWiwGreD87g6pEsuBtui6WuaAQ53GxNzJ4q_5BlDemMzchI0axU44Y1EiajOyTCBavRYBXk7g4Zi4MYonob1uQF220w&src-supplier=Compliance+Statements; ComponentLink32Description: https://octopart.com:443/opatz8j6/c1?t=FFG_DC80JtruglX_HDP91gzsMwR13fxxkH_F3qcsgv835Sckaqh0XoMMkjr9Xm6n53vUMcFhZdRxZUaOiXKEpziVr_MHF241f_irKM6sV7CDFCSg9OIr6yiMkTD2zr6wiIa6WV_NkigJy29Fhwmg1m-UuSG1FnEbeldEUFG0L2j6ZHDzDhgkJHKMYl647Yu2VnJhiyvnXuXJW9BQy0wQcz7wOqUYovLIYLqOxKZMCY31ibnz1zvaL2IfdgsKEKbqjrdm2M9R683KWiwGreD87g6pEsuBtui6WuaAQ53GxNzJ4q_5BlDemMzchI0axU44Y1EiajOyTCBavRYBXk7g4Zi4MYonob1uQF220w&src-supplier=Compliance+Statements; Supplier 1: https://www.chipdip.ru/product/fod817bsd-optoizolyator-5kv-optopara-on-semiconductor-9000101821
L5 L6 L8 = SPRH127-221M: 220мкГн, 2.22А, 12.3х12.3х8 мм, Катушка индуктивности SMD; Current - Saturation (Isat): 2.22A; Current Rating (Amps): 1.63A; Supplier 1: https://www.chipdip.ru/product/cdsprh127-221m-220mkgn-2.22a-12.3x12.3x8-mm-katushka-sce-9001493335
L7 L9 = SDR0805-331KL: 330мкГн, 0.4А, Индуктивность SMD; Current - Saturation (Isat): 580 mA; Current Rating (Amps): 400 mA; Supplier 1: https://www.chipdip.ru/product/sdr0805-331kl-330mkgn-0.4a-induktivnost-smd-bourns-9000090969
R22 R31 = Res_1206: Резистор; Manufacturer Part Number: RC1206JR-071RL; Tolerance: 5%; Power: 0.25Вт; Supplier 1: https://www.chipdip.ru/product/0.25vt-1206-1-om-5-rc1206jr-071rl-chip-rezistor-smd-yageo-9000226200
R23 R27 R32 R33 = Res_1206: Резистор; Manufacturer Part Number: RC1206JR-0733RL; Tolerance: 5%; Power: 0,25Вт; Supplier 1: https://www.chipdip.ru/product/0.25vt-1206-33-om-5-rc1206jr-0733rl-chip-rezistor-smd-yageo-9000247852
R24 R25 = Res_1206: Резистор; Manufacturer Part Number: RC1206JR-07820RL; Tolerance: 5%; Power: 0.25Вт; Supplier 1: https://www.chipdip.ru/product/0.25vt-1206-820-om-5-rc1206jr-07820rl-chip-rezistor-yageo-9000956179
R26 R28 R29 = Res_0603: Резистор; Manufacturer Part Number: AS03W4J0391T5E; Power: 250мВт; Tolerance: 5%; Supplier 1: https://www.chipdip.ru/product/as03w4j0391t5e-tolstoplenochnyy-rezistor-250mvt-uni-royal-8016244225
R30 = Res_0603: Резистор; Manufacturer Part Number: RC0603JR-0710KL; Power: 0.1Вт; Tolerance: 5%; Supplier 1: https://www.chipdip.ru/product/0.1vt-0603-10-kom-5-rc0603jr-0710kl-chip-rezistor-smd-yageo-9000103456
VD9 VD12 = STTH2R06A: Rectifier Diode, 1 Phase, 1 Element, 2A, 600V V(RRM), Silicon; Manufacturer: STMicroelectronics; Element Configuration: Single; Forward Voltage: 1.25V; Max Forward Surge Current (Ifsm): 30A; Max Junction Temperature (Tj): 175°C; Number of Elements: 1; Peak Reverse Current: 2µA; Polarity: Standard; Recovery Time: 50ns; Supplier: RS; Supplier Part Number: 1685754; Manufacturer Part Number: STTH2R06A; RoHS: Compliant; Category: Rectifier Diodes; Stock: 4220; Pricing: 5000=0,1 (GBP); Average Rectified Current: 2A; Case/Package: SMA; China RoHS: Non-Compliant; Contact Plating: Tin; Country of Origin: Mainland China; Current Rating: 2A; Export Control Classification Number (ECCN) Code: EAR99; Forward Current: 2A; Height: 2.03mm; Harmonized Tariff Schedule (HTS) Code: 8541.10.00.80; Introduction Date: 2004-09-07; Lead Free: Lead Free; Length: 4.6mm; Lifecycle Status: Production; Max Operating Temperature: 175°C; Max Output current: 2A; Max Repetitive Reverse Voltage (Vrrm): 600V; Max Reverse Voltage (DC): 600V; Max Surge Current: 30A; Min Operating Temperature: -40°C; Mounting Technology: Surface Mount; Pins: 2; Number of Terminals: 2; Output Current: 2A; Packaging: Tape and Reel; Peak Non-Repetitive Surge Current: 30A; Radiation Hardening: No; REACH SVHC: No; Reverse Recovery Time: 50ns; Reverse Standoff Voltage: 600V; Reverse Voltage: 600V; Schedule B: 8541100080, 8541100080|8541100080|8541100080|8541100080|8541100080; Voltage Rating (DC): 600V; Width: 2.95mm; ComponentLink1URL: https://datasheet.octopart.com:443/STTH2R06A-STMicroelectronics-datasheet-8449154.pdf?src-supplier=element14+APAC; ComponentLink1Description: https://datasheet.octopart.com:443/STTH2R06A-STMicroelectronics-datasheet-8449154.pdf?src-supplier=element14+APAC; ComponentLink2URL: https://datasheet.octopart.com:443/STTH2R06A-STMicroelectronics-datasheet-12526389.pdf?src-supplier=Newark; ComponentLink2Description: https://datasheet.octopart.com:443/STTH2R06A-STMicroelectronics-datasheet-12526389.pdf?src-supplier=Newark; ComponentLink3URL: https://datasheet.octopart.com:443/STTH2R06A-STMicroelectronics-datasheet-14054141.pdf?src-supplier=iiiC; ComponentLink3Description: https://datasheet.octopart.com:443/STTH2R06A-STMicroelectronics-datasheet-14054141.pdf?src-supplier=iiiC; ComponentLink4URL: https://datasheet.octopart.com:443/STTH2R06A-STMicroelectronics-datasheet-8633837.pdf?src-supplier=Jameco; ComponentLink4Description: https://datasheet.octopart.com:443/STTH2R06A-STMicroelectronics-datasheet-8633837.pdf?src-supplier=Jameco; ComponentLink5URL: https://datasheet.octopart.com:443/STTH2R06A-STMicroelectronics-datasheet-30637.pdf?src-supplier=DigiKey; ComponentLink5Description: https://datasheet.octopart.com:443/STTH2R06A-STMicroelectronics-datasheet-30637.pdf?src-supplier=DigiKey; Supplier 1: https://www.chipdip.ru/product/stth2r02a-st-microelectronics-8000276925
VD10 VD11 VD13 VD14 = SMAJ12CA: Диод защитный от перенапряжения - TVS (супрессор) 12В включение 19.9В ограничение SMA; Maximum Clamping Voltage (V): 25.3 V; Maximum Peak Pulse Current (A): 91 A; Minimum Breakdown Voltage (V): 13.3 V; Breakdown Voltage: 14 V; Supplier 1: https://www.chipdip.ru/product/smaj12ca-tr-st-microelectronics-8124212433
VT1-VT4 = FQD12N20LTM: Fairchild Semiconductor’s new QFET® planar MOSFETs use advanced, proprietary technology to offer best-in-class operating performance for a wide range of applications, including power supplies, PFC (Power Factor Correction), DC-DC Converters, Plasma Display Panels (PDP), lighting ballasts, and motion control.; Continuous Drain Current Id: 9A; Rds(on) Test Voltage: 10V; Power Dissipation: 2.5W; Drain Source On State Resistance: 0.28ohm; Channel Type: N Channel; Gate Source Threshold Voltage Max: 2V; Drain Source Voltage Vds: 200V; Supplier 1: https://www.chipdip.ru/product/fqd12n20ltm-tranzistor-n-mosfet-200v-9a-on-semiconductor-9050001558
X7 = DG127-5.08-02P: Terminal block DG127-5.08-02P-14-00AH, 2-ways, vertical, 5.08mm, screw (-), green, max wire 1.5mm2, RoHS; Supplier 1: https://www.chipdip.ru/product0/8001774499
X8 X9 = DG308-2.54-02P: as X5#2 on sheet Power_Management; Supplier 1: https://www.chipdip.ru/product/dg308-2.54-02p-14-00ah-308-021-14-klemmnik-vintovoy-degson-63066?from=visited_product

## Sheet Console.SchDoc
size 209 x 297 mm; SheetNumber: 4; SheetTotal: 4; PageSetup: Record=PageOptionsZCenterHorizontal=TrueZCenterVertical=TrueZPrintScale=0.95ZXCorrection=1.00ZYCorrection=1.00ZPrintKind=2ZBorderSize=5000000ZLeftOffset=0ZBottomOffset=0ZOrientation=1ZPaperLength=1000ZPaperWidth=1000ZScale=100ZPaperSource=7ZPrintQuality=600ZMediaType=1ZDitherType=10ZPaperKind=A4 (210 x 297 мм)ZPrintScaleMode=1
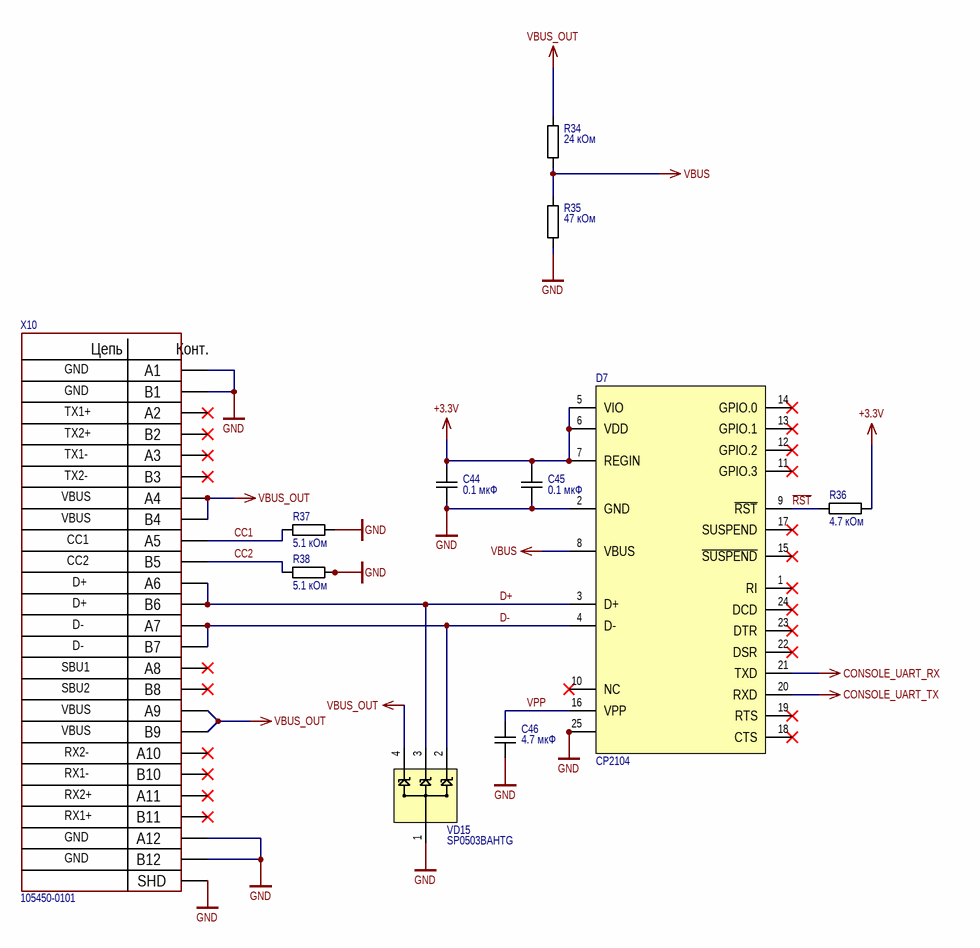
[diagram p3: Console.SchDoc]

### Parts
C44  value 0.1 мкФ  [CAP-0603]  (hidden comment: CAP-0.1 мкФ-10%-16 В-X7R-0603)
C45  value 0.1 мкФ  [CAP-0603]  (hidden comment: CAP-0.1 мкФ-10%-16 В-X7R-0603)
C46  value 4.7 мкФ  [CAP-0603]  (hidden comment: CAP-4.7 мкФ-10%-35 В-X5R-0603)
D7  CP2104  [QFN-24]
R34  value 24 кОм  [RES-0603]  (hidden comment: RES-24 кОм-1%-0.1 Вт-0603)
R35  value 47 кОм  [RES-0603]  (hidden comment: RES-47 кОм-1%-0.1 Вт-0603)
R36  value 4.7 кОм  [RES-0603]  (hidden comment: RES-4.7 кОм-1%-0.1 Вт-0603)
R37  value 5.1 кОм  [RES-0603]  (hidden comment: RES-5.1 кОм-1%-0.1 Вт-0603)
R38  value 5.1 кОм  [RES-0603]  (hidden comment: RES-5.1 кОм-1%-0.1 Вт-0603)
VD15  SP0503BAHTG  [SOT-143]
X10  105450-0101  B12: GND  B11: RX1+  A11: RX2+  B10: RX1-  A10: RX2-  B9: VBUS  B8: SBU2  A8: SBU1  B7: D-  B6: D+  B5: CC2  A5: CC1  B3: TX2-  A3: TX1-  B2: TX2+  A2: TX1+  [USB-C]

### Nets
+3.3V: C44.2 C45.2 D7.5(VIO) D7.6(VDD) D7.7(REGIN) R36.1
CONSOLE_UART_RX: D7.21(TXD)
CONSOLE_UART_TX: D7.20(RXD)
GND: C44.1 C45.1 C46.1 D7.2(GND) D7.25 R35.2 R37.1 R38.1 VD15.1 X10.A1 X10.A12 X10.B1 X10.B12 X10.SHD
VBUS: D7.8(VBUS) R34.2 R35.1
VBUS_OUT: R34.1 VD15.4 X10.A4 X10.A9 X10.B4 X10.B9
CC1: R37.2 X10.A5
CC2: R38.2 X10.B5
D+: D7.3(D+) VD15.3 X10.A6 X10.B6
D-: D7.4(D-) VD15.2 X10.A7 X10.B7
~{RST}: D7.9(~{RST}) R36.2
VPP: C46.2 D7.16(VPP)

Not connected (* = marked no-connect by the designer): D7 1(RI)* 10(NC)* 11(GPIO.3)* 12(GPIO.2)* 13(GPIO.1)* 14(GPIO.0)* 15(~{SUSPEND})* 17(SUSPEND)* 18(CTS)* 19(RTS)* 22(DSR)* 23(DTR)* 24(DCD)*; X10 2(B2)* A2* A3* A8* A10* A11* B3* B8* B10* B11*

### Notes on the sheet
- Перв. примен.
- Справ. №
- Подп. и дата
- Инв. № дубл.
- Взам. инв. №
- Изм.
- Лист
- № докум.
- Подп.
- Дата
- Инв. № подл.
- Копировал
- Формат А4
- (in symbol 105450-0101) Цепь; Конт.

### Library data of the parts
C44 C45 = Cap_0603: Конденсатор; Manufacturer Part Number: GRM188R71C104KA01D; Tolerance: 10%; Voltage: 16 В; Temperature: X7R; Supplier 1: https://www.chipdip.ru/product/grm188r71c104ka01d
C46 = Cap_0603: Конденсатор; Manufacturer Part Number: GRM188R6YA475KE15D; Tolerance: 10%; Voltage: 35 В; Temperature: X5R; Supplier 1: https://www.chipdip.ru/product0/8021864804
D7 = CP2104-F03-GMR: Interface IC full speed basic USB type-C controller USB 2.0 3.3V, CP2104-F03-GMR, WFQFN-24; Manufacturer: Silicon Labs; Supplier: Mouser; Supplier Part Number: 634-CP2104-F03-GMR; Manufacturer Part Number: CP2104-F03-GMR; RoHS: Yes; Category: Interface ICs; Stock: 2589; Pricing: 1=5,43, 10=4,87, 50=4,87, 100=3,99, 1000=2,87, 10000=2,62 (USD); Height: 800um; ComponentLink1URL: https://datasheet.ciiva.com/14939/cp2104-14939979.pdf?src-supplier=Digikey; ComponentLink1Description: https://datasheet.ciiva.com/14939/cp2104-14939979.pdf?src-supplier=Digikey; ComponentLink2URL: https://datasheet.ciiva.com/15150/getdatasheetpartid-711722-15150533.pdf?src-supplier=Verical; ComponentLink2Description: https://datasheet.ciiva.com/15150/getdatasheetpartid-711722-15150533.pdf?src-supplier=Verical; Supplier 1: https://www.chipdip.ru/product0/8023203867
R34 = Res_0603: Резистор; Manufacturer Part Number: RC0603FR-0724KL; Power: 0.1 Вт; Tolerance: 1%; Supplier 1: https://www.chipdip.ru/product/0.1w-0603-24-kom-1
R35 = Res_0603: Резистор; Manufacturer Part Number: RC0603FR-0747KL; Power: 0.1 Вт; Tolerance: 1%; Supplier 1: https://www.chipdip.ru/product/0.1w-0603-47-kom-1
R36 = Res_0603: Резистор; Manufacturer Part Number: RC0603FR-074K7L; Power: 0.1 Вт; Tolerance: 1%; Supplier 1: https://www.chipdip.ru/product/0.1w-0603-4.7-kom-1
R37 R38 = Res_0603: Резистор; Manufacturer Part Number: RC0603FR-075K1L; Power: 0.1 Вт; Tolerance: 1%; Supplier 1: https://www.chipdip.ru/product/0.1w-0603-5.1-kom-1
VD15 = SP0503BAHTG: SP050xBA Series 8.5 V 30 pF Triple Uni-Directional TVS Avalanche Diode-SOT143-4; Manufacturer: Littelfuse; Operating Supply Voltage: 5.5V; Direction: Unidirectional; Value: 30pF; Number of Channels: 3; Clamping Voltage: 7.8V; Power Line Protection: No; Polarity: Bidirectional,Unidirectional; Max Power Dissipation: 225mW; ESD Protection: Yes; Max Reverse Leakage Current: 100nA; Voltage Rating (DC): 5V; Clamping Voltage-Max: 8V; Supplier: Arrow Electronics; Supplier Part Number: SP0503BAHTG; Manufacturer Part Number: SP0503BAHTG; RoHS: Yes; Category: TVS Diodes; Stock: 87000; Pricing: 3000=0,2519, 9000=0,2382 (USD); Mounting Technology: Surface Mount; Case/Package: SOT-143; Pins: 4; Min Operating Temperature: -40°C; Max Operating Temperature: 85°C; Packaging: Tape and Reel; Number of Unidirectional Channels: 3; Reverse Standoff Voltage: 5.5V; Breakdown Voltage: 5.5V; Termination: SMD/SMT; Working Voltage: 5.5V; Peak Pulse Power: 225mW; Leakage Current: 100nA; Number of Elements: 3; Power Dissipation: 225mW; Diode Type: Avalanche; Series: SP05, SPA®; Length: 3.04mm; Width: 1.4mm; Height: 1.05mm; Depth: 1.4mm; Radiation Hardening: No; Reach SVHC Compliant: No; Lead Free: Lead Free; RoHS Compliant: Yes; ComponentLink1URL: https://datasheet.ciiva.com/15143/getdatasheetpartid-116020-15143550.pdf?src-supplier=Verical; ComponentLink1Description: https://datasheet.ciiva.com/15143/getdatasheetpartid-116020-15143550.pdf?src-supplier=Verical; ComponentLink2URL: https://datasheet.ciiva.com/7650/526672-7650894.pdf?src-supplier=Element14; ComponentLink2Description: https://datasheet.ciiva.com/7650/526672-7650894.pdf?src-supplier=Element14; ComponentLink3URL: https://datasheet.ciiva.com/8062/littefuse-spa-sp050x-8062422.pdf?src-supplier=Element14; ComponentLink3Description: https://datasheet.ciiva.com/8062/littefuse-spa-sp050x-8062422.pdf?src-supplier=Element14; ComponentLink4URL: https://datasheet.ciiva.com/22697/1911798-22697942.pdf?src-supplier=Element14; ComponentLink4Description: https://datasheet.ciiva.com/22697/1911798-22697942.pdf?src-supplier=Element14; ComponentLink5URL: https://datasheet.ciiva.com/4509/sp05x-leadfree-4509162.pdf?src-supplier=Mouser; ComponentLink5Description: https://datasheet.ciiva.com/4509/sp05x-leadfree-4509162.pdf?src-supplier=Mouser; ComponentLink6URL: https://datasheet.ciiva.com/332/sp05xxba-332551.pdf?src-supplier=Digikey; ComponentLink6Description: https://datasheet.ciiva.com/332/sp05xxba-332551.pdf?src-supplier=Digikey; ComponentLink7URL: https://datasheet.ciiva.com/332/sp05xxba-332552.pdf?src-supplier=Digikey; ComponentLink7Description: https://datasheet.ciiva.com/332/sp05xxba-332552.pdf?src-supplier=Digikey; ComponentLink8URL: https://datasheet.ciiva.com/332/sp05xxba-332550.pdf?src-supplier=Digikey; ComponentLink8Description: https://datasheet.ciiva.com/332/sp05xxba-332550.pdf?src-supplier=Digikey; ComponentLink9URL: https://datasheet.ciiva.com/16449/sp05xxba-16449463.pdf?src-supplier=Future+Electronics; ComponentLink9Description: https://datasheet.ciiva.com/16449/sp05xxba-16449463.pdf?src-supplier=Future+Electronics; Supplier 1: https://www.chipdip.ru/product/sp0503bahtg
X10 = 105450-0101: USB Connector, 24 Contact(s), Female, Right Angle, Surface Mount Terminal, Receptacle; Manufacturer: Molex; Plating: 157ConductorMaterial; Number of Contacts: 24; Number of Ports: 1; USB Standard: USB 3.1; Mating Cycles: 10000; Shielding: Shielded; Number of Circuits: 24NUMBER; Voltage Rating: 30V; Pitch: 0.5mm; Supplier: Mouser; Supplier Part Number: 538-105450-0101; Manufacturer Part Number: 105450-0101; RoHS: Yes; Category: USB Connectors; Stock: 17652; Pricing: 1=2,38, 10=2,03, 50=2,03, 100=1,79, 1000=1,67, 10000=1,41 (USD); Mounting Technology: Surface Mount,Horizontal,Through Hole; Case/Package: 0101; Pins: 24; Contact Material: Copper Alloy; Contact Plating: Gold; Housing Material: Thermoplastic; Insulation Color: Black; Min Operating Temperature: -30°C; Max Operating Temperature: 85°C; Packaging: Tape and Reel; Connector Type: USB; Gender: Receptacle; Orientation: Right Angle; Termination: Solder; Features: Shielded; Series: -; Number of Rows: 2NUMBER; Length: 8.94mm; Height: 3.44mm; Flammability Rating: UL94 V-0; RoHS Compliant: Yes; Reach SVHC Compliant: Unknown; ComponentLink1URL: http://www.farnell.com/datasheets/2801634.pdf?src-supplier=Farnell; ComponentLink1Description: http://www.farnell.com/datasheets/2801634.pdf?src-supplier=Farnell; ComponentLink2URL: http://www.farnell.com/datasheets/2801634.pdf?src-supplier=Newark; ComponentLink2Description: http://www.farnell.com/datasheets/2801634.pdf?src-supplier=Newark; ComponentLink3URL: http://www.literature.molex.com/SQLImages/kelmscott/Molex/PDF_Images/987651-4081.PDF?src-supplier=Avnet; ComponentLink3Description: http://www.literature.molex.com/SQLImages/kelmscott/Molex/PDF_Images/987651-4081.PDF?src-supplier=Avnet; ComponentLink4URL: http://www.farnell.com/datasheets/2015275.pdf?src-supplier=Element14; ComponentLink4Description: http://www.farnell.com/datasheets/2015275.pdf?src-supplier=Element14; ComponentLink5URL: http://www.farnell.com/datasheets/2801634.pdf?src-supplier=Element14; ComponentLink5Description: http://www.farnell.com/datasheets/2801634.pdf?src-supplier=Element14; ComponentLink6URL: http://www.farnell.com/datasheets/2672741.pdf?src-supplier=Newark; ComponentLink6Description: http://www.farnell.com/datasheets/2672741.pdf?src-supplier=Newark; Supplier 1: https://www.chipdip.ru/product/105450-0101-molex; A12: GND; A9: VBUS; A7: D-; A6: D+; B4: VBUS; A4: VBUS; B1: GND; A1: GND

## Nets that join several sheets
+3.3V: MCU_Control (25 pins), Power_Management (9 pins), Console (6 pins)
+12V: MCU_Control (6 pins), Power_Management (C19#2.P L3.2 R5#2.2 VD2#2.1), HV_Piezo_Driver (12 pins)
~{AMP_EN}: MCU_Control (DD1.43 X5#1.2), HV_Piezo_Driver (R29.1)
CONSOLE_UART_RX: MCU_Control (DD1.48), Console (D7.21)
CONSOLE_UART_TX: MCU_Control (DD1.47), Console (D7.20)
GND: MCU_Control (41 pins), Power_Management (27 pins), HV_Piezo_Driver (24 pins), Console (14 pins)
~{PWM_CONTROL}: MCU_Control (DD1.41 X5#1.4), HV_Piezo_Driver (R28.1)
PWM_CONTROL: MCU_Control (DD1.42 X5#1.3), HV_Piezo_Driver (R26.1)
PWR_MON_ALERT: MCU_Control (DD1.91), Power_Management (D2.3 R11.1)
PWR_MON_SCL: MCU_Control (DD1.92), Power_Management (D2.5 R13.1)
PWR_MON_SDA: MCU_Control (DD1.93), Power_Management (D2.4 R12.1)